# Altium schematic sheet USB.SchDoc
size A4; SheetNumber: 8; SheetTotal: 9
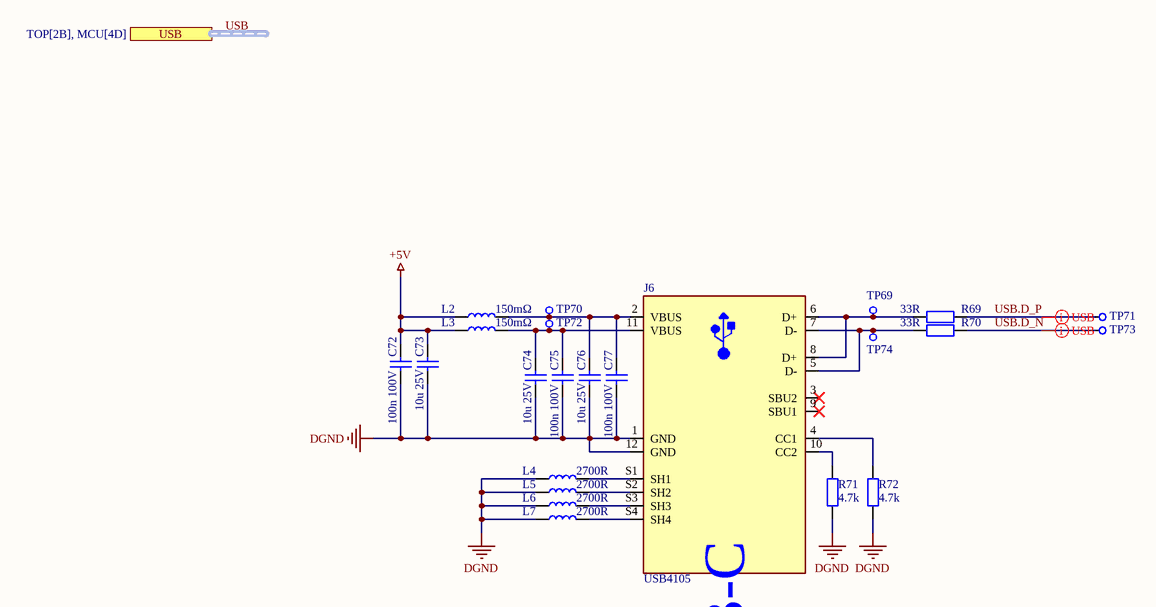
[diagram p0: USB.SchDoc]

## Parts
C72  100n 100V  [CAPACITOR 0805]
C73  10u 25V  [CAPACITOR 0805]
C74  10u 25V  [CAPACITOR 0805]
C75  100n 100V  [CAPACITOR 0805]
C76  10u 25V  [CAPACITOR 0805]
C77  100n 100V  [CAPACITOR 0805]
J6  USB4105  [MECHANICAL USB USB4105]
L2  150mΩ  [FERRITE 0805]
L3  150mΩ  [FERRITE 0805]
L4  2700R  [FERRITE 0805]
L5  2700R  [FERRITE 0805]
L6  2700R  [FERRITE 0805]
L7  2700R  [FERRITE 0805]
R69  33R  [RESISTOR 0805]
R70  33R  [RESISTOR 0805]
R71  4.7k  [RESISTOR 0805]
R72  4.7k  [RESISTOR 0805]
TP69  1mm  [TEST POINT 1MM]  (value not drawn)
TP70  1mm  [TEST POINT 1MM]  (value not drawn)
TP71  1mm  [TEST POINT 1MM]  (value not drawn)
TP72  1mm  [TEST POINT 1MM]  (value not drawn)
TP73  1mm  [TEST POINT 1MM]  (value not drawn)
TP74  1mm  [TEST POINT 1MM]  (value not drawn)

## Ports
USB (harness USB, see TOP[2B], MCU[4D])

## Nets
+5V: C72.2 C73.2 L2.1 L3.1
DGND: C72.1 C73.1 C74.1 C75.1 C76.1 C77.1 J6.1(GND) J6.12(GND) L4.1 L5.1 L6.1 L7.1 R71.1 R72.1
USB.D_N: R70.2 TP73.1
USB.D_P: R69.2 TP71.1
NetC74_2: C74.2 C75.2 J6.11(VBUS) L3.2 TP72.1
NetC76_2: C76.2 C77.2 J6.2(VBUS) L2.2 TP70.1
NetJ6_4: J6.4(CC1) R72.2
NetJ6_5: J6.5(D-) J6.7(D-) R70.1 TP74.1
NetJ6_6: J6.6(D+) J6.8(D+) R69.1 TP69.1
NetJ6_10: J6.10(CC2) R71.2
NetJ6_S1: J6.S1(SH1) L4.2
NetJ6_S2: J6.S2(SH2) L5.2
NetJ6_S3: J6.S3(SH3) L6.2
NetJ6_S4: J6.S4(SH4) L7.2

Not connected (* = marked no-connect by the designer): J6 3(SBU2)* 9(SBU1)*

## Buses and harness runs
harness USB = port USB

## Layout directives
differential pair; Parameter 1: USB: USB.D_N, USB.D_P

## Notes on the sheet
- (in symbol Mechanical USB-C Right Angle MUSBRM1C130) USB-C

## Library data of the parts
C72 C75 C77 = Capacitor 100n 100V 10% X7R 0805: Capacitor: ceramic; MLCC; 100nF; 100V; X7R; ±10%; SMD; 0805; Manufacturer: YAGEO; Manufacturer Part Number: CC0805KKX7R0BB104; ComponentLink1Description: Datasheet; ComponentLink1URL: https://www.tme.eu/Document/fbb9415081fcefba62c0f8bbf5b21210/UPY-GPHC_X7R_6.3V-to-50V_20.pdf; Footprint: Capacitor 0805; Price 10pcs [$]: 0.0770; Supplier: TME
C73 C74 C76 = Capacitor 10u 25V 10% X5R 0805: Capacitor: ceramic; MLCC; 10uF; 25V; X5R; ±10%; SMD; 0805; Manufacturer: MURATA; Manufacturer Part Number: GRM21BR61E106KA73K; ComponentLink1Description: Datasheet; ComponentLink1URL: https://www.tme.eu/Document/58bb7db4269ac3ad53d1aa3c0ade9bab/GRM.pdf; Footprint: Capacitor 0805; Price 10pcs [$]: 0.0784; Supplier: TME
J6 = Mechanical USB-C Right Angle MUSBRM1C130: Socket; USB C; SMT; PIN: 16; horizontal; top board mount; USB 2.0; Manufacturer: GCT; Manufacturer Part Number: USB4105-GF-A; ComponentLink1Description: Datasheet; ComponentLink1URL: https://gct.co/Files/Drawings/USB4105.pdf?v=dfccde62-75d7-4236-8ef4-6cd7ea57494a; Price 10pcs [$]: 0.865; Supplier: TME
L2 L3 = Inductor Ferrite Bead 150mΩ 0805 1A: Inductor: ferrite; SMD; 0805; 2.2uH; 1A; 150mΩ; 2MHz; ±20%; -40÷125°C; Manufacturer: TDK; Manufacturer Part Number: MLP2012H2R2MT0S1; ComponentLink1Description: Datasheet; ComponentLink1URL: https://www.tme.eu/Document/ba697dde332dbf0a0abfb0dda9326bd0/mlp2012.pdf; Price 10pcs [$]: 0.23; Supplier: TME
L4-L7 = Inductor Ferrite Bead 2700Ω 0805 0.2A: Ferrite: bead; 2700Ω; SMD; 200mA; 0805; -55÷125°C; Manufacturer: MURATA; Manufacturer Part Number: BLM21BD272SN1L; ComponentLink1Description: Datasheet; ComponentLink1URL: https://www.tme.eu/Document/c9c44cce174b2958868ee1fe8b54450c/BLM21B222SPT-DTE.pdf; Price 10pcs [$]: 0.11; Supplier: TME
R69 R70 = Resistor 33R 1% 1/8W 0805: Resistor: thick film; SMD; 0805; 33Ω; 0.125W; ±1%; -55÷155°C; Manufacturer: Yageo; Manufacturer Part Number: RC0805FR-0733R; ComponentLink1Description: Datasheet; ComponentLink1URL: https://www.tme.eu/Document/7b8fed8c112f8a94930279c22c957f7f/rc0805yageo.pdf; Footprint: Resistor 0805; Price 10pcs [$]: 0.023; Supplier: TME
R71 R72 = Resistor 4.7k 1% 1/8W 0805: Resistor: thick film; SMD; 0805; 4.7kΩ; 0.125W; ±1%; -55÷155°C; Manufacturer: Yageo; Manufacturer Part Number: RC0805FR-074K7; ComponentLink1Description: Datasheet; ComponentLink1URL: https://www.tme.eu/Document/7b8fed8c112f8a94930279c22c957f7f/rc0805yageo.pdf; Price 10pcs [$]: 0.02250; Supplier: TME
TP69-TP74 = Mechanical Test Point 1mm: Tesp Point 1mm; ComponentLink1Description: Datasheet; ComponentLink1URL: -; Manufacturer: -; Manufacturer Part Number: -; Footprint: -; Price 10pcs [$]: -; Supplier: -